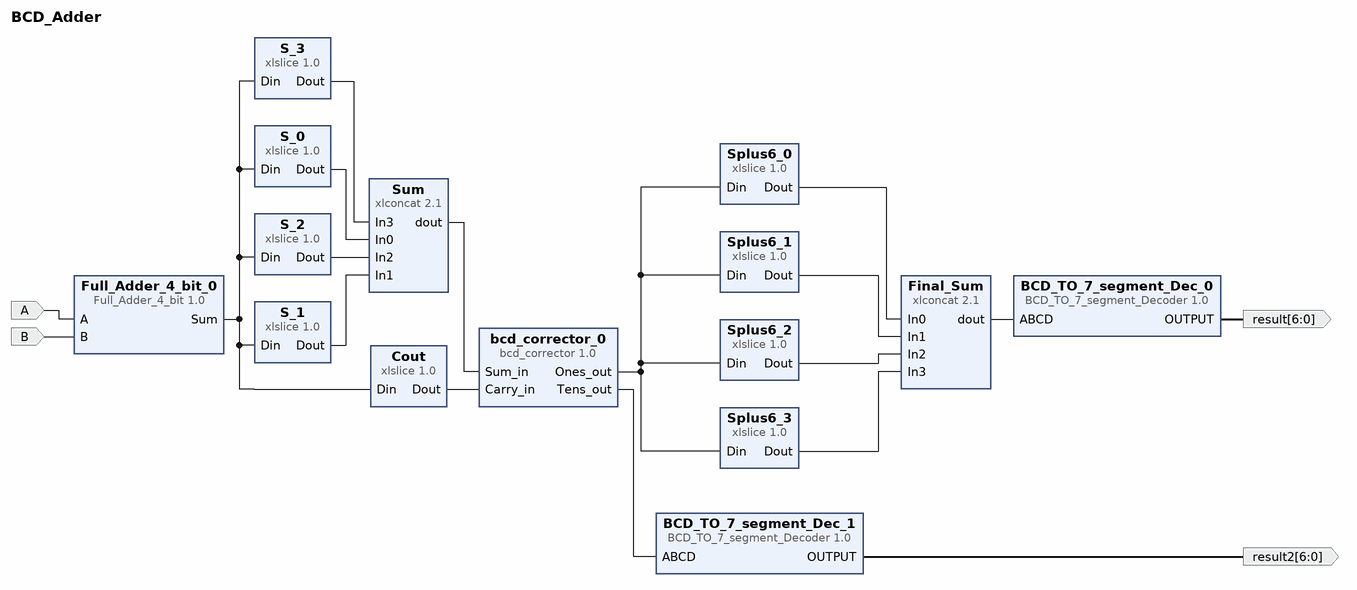
[diagram p0: block diagram of the top level]
# Vivado block design BCD_Adder, xc7vx485tffg1157-1, Vivado 2025.1
create_bd_design BCD_Adder

create_bd_port -dir I A
create_bd_port -dir I B
create_bd_port -dir O -from 6 -to 0 result
create_bd_port -dir O -from 6 -to 0 result2

create_bd_cell -type ip -vlnv xilinx.com:user:BCD_TO_7_segment_Decoder:1.0 BCD_TO_7_segment_Dec_0
create_bd_cell -type ip -vlnv xilinx.com:user:Full_Adder_4_bit:1.0 Full_Adder_4_bit_0
create_bd_cell -type ip -vlnv xilinx.com:user:bcd_corrector:1.0 bcd_corrector_0
create_bd_cell -type ip -vlnv xilinx.com:ip:xlslice:1.0 S_0
set_property -dict {CONFIG.DIN_WIDTH 5} [get_bd_cells S_0]
create_bd_cell -type ip -vlnv xilinx.com:ip:xlslice:1.0 S_1
set_property -dict {CONFIG.DIN_FROM 1 CONFIG.DIN_TO 1 CONFIG.DIN_WIDTH 5} [get_bd_cells S_1]
create_bd_cell -type ip -vlnv xilinx.com:ip:xlslice:1.0 S_2
set_property -dict {CONFIG.DIN_FROM 2 CONFIG.DIN_TO 2 CONFIG.DIN_WIDTH 5} [get_bd_cells S_2]
create_bd_cell -type ip -vlnv xilinx.com:ip:xlslice:1.0 S_3
set_property -dict {CONFIG.DIN_FROM 3 CONFIG.DIN_TO 3 CONFIG.DIN_WIDTH 5} [get_bd_cells S_3]
create_bd_cell -type ip -vlnv xilinx.com:ip:xlslice:1.0 Cout
set_property -dict {CONFIG.DIN_FROM 4 CONFIG.DIN_TO 4 CONFIG.DIN_WIDTH 5} [get_bd_cells Cout]
create_bd_cell -type ip -vlnv xilinx.com:ip:xlconcat:2.1 Sum
set_property -dict {CONFIG.NUM_PORTS 4} [get_bd_cells Sum]
create_bd_cell -type ip -vlnv xilinx.com:ip:xlslice:1.0 Splus6_0
set_property -dict {CONFIG.DIN_WIDTH 5} [get_bd_cells Splus6_0]
create_bd_cell -type ip -vlnv xilinx.com:ip:xlslice:1.0 Splus6_1
set_property -dict {CONFIG.DIN_FROM 1 CONFIG.DIN_TO 1 CONFIG.DIN_WIDTH 5} [get_bd_cells Splus6_1]
create_bd_cell -type ip -vlnv xilinx.com:ip:xlslice:1.0 Splus6_2
set_property -dict {CONFIG.DIN_FROM 2 CONFIG.DIN_TO 2 CONFIG.DIN_WIDTH 5} [get_bd_cells Splus6_2]
create_bd_cell -type ip -vlnv xilinx.com:ip:xlslice:1.0 Splus6_3
set_property -dict {CONFIG.DIN_FROM 3 CONFIG.DIN_TO 3 CONFIG.DIN_WIDTH 5} [get_bd_cells Splus6_3]
create_bd_cell -type ip -vlnv xilinx.com:ip:xlconcat:2.1 Final_Sum
set_property -dict {CONFIG.NUM_PORTS 4} [get_bd_cells Final_Sum]
create_bd_cell -type ip -vlnv xilinx.com:user:BCD_TO_7_segment_Decoder:1.0 BCD_TO_7_segment_Dec_1

# ---- connections ----

connect_bd_net [get_bd_ports A] [get_bd_pins Full_Adder_4_bit_0/A]
connect_bd_net [get_bd_pins BCD_TO_7_segment_Dec_0/OUTPUT] [get_bd_ports result]
connect_bd_net [get_bd_pins BCD_TO_7_segment_Dec_1/OUTPUT] [get_bd_ports result2]
connect_bd_net [get_bd_ports B] [get_bd_pins Full_Adder_4_bit_0/B]
connect_bd_net [get_bd_pins Cout/Dout] [get_bd_pins bcd_corrector_0/Carry_in]
connect_bd_net [get_bd_pins Full_Adder_4_bit_0/Sum] \
  [get_bd_pins S_1/Din] [get_bd_pins S_2/Din] [get_bd_pins S_3/Din] [get_bd_pins Cout/Din] [get_bd_pins S_0/Din]
connect_bd_net -net Full_Adder_4_bit_1_Sum [get_bd_pins bcd_corrector_0/Ones_out] \
  [get_bd_pins Splus6_0/Din] [get_bd_pins Splus6_1/Din] [get_bd_pins Splus6_2/Din] [get_bd_pins Splus6_3/Din]
connect_bd_net [get_bd_pins S_0/Dout] [get_bd_pins Sum/In0]
connect_bd_net [get_bd_pins S_1/Dout] [get_bd_pins Sum/In1]
connect_bd_net [get_bd_pins S_2/Dout] [get_bd_pins Sum/In2]
connect_bd_net [get_bd_pins S_3/Dout] [get_bd_pins Sum/In3]
connect_bd_net -net Sum1_dout [get_bd_pins Final_Sum/dout] [get_bd_pins BCD_TO_7_segment_Dec_0/ABCD]
connect_bd_net [get_bd_pins Sum/dout] [get_bd_pins bcd_corrector_0/Sum_in]
connect_bd_net [get_bd_pins bcd_corrector_0/Tens_out] [get_bd_pins BCD_TO_7_segment_Dec_1/ABCD]
connect_bd_net -net xlslice_0_Dout [get_bd_pins Splus6_0/Dout] [get_bd_pins Final_Sum/In0]
connect_bd_net -net xlslice_1_Dout [get_bd_pins Splus6_1/Dout] [get_bd_pins Final_Sum/In1]
connect_bd_net -net xlslice_2_Dout [get_bd_pins Splus6_2/Dout] [get_bd_pins Final_Sum/In2]
connect_bd_net -net xlslice_3_Dout [get_bd_pins Splus6_3/Dout] [get_bd_pins Final_Sum/In3]

validate_bd_design
save_bd_design
